# Altium schematic sheet Brain-PCB_MASTER.SchDoc
size B; SheetNumber: 1; SheetTotal: 12
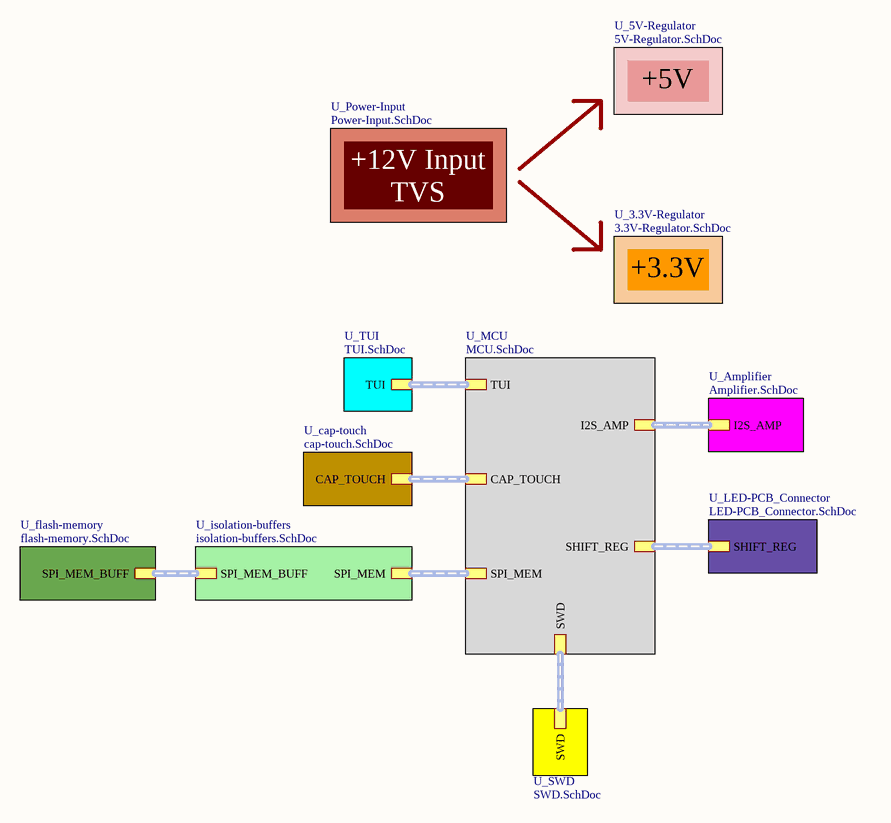
[diagram p0: Brain-PCB_MASTER.SchDoc]

## Sub-sheets
U_3.3V-Regulator = 3.3V-Regulator.SchDoc: no entries
U_5V-Regulator = 5V-Regulator.SchDoc: no entries
U_Amplifier = Amplifier.SchDoc: I2S_AMP (harness I2S_AMP)
U_cap-touch = cap-touch.SchDoc: CAP_TOUCH (harness CAP_TOUCH)
U_flash-memory = flash-memory.SchDoc: SPI_MEM_BUFF (harness SPI_MEM_BUFF)
U_isolation-buffers = isolation-buffers.SchDoc: SPI_MEM (harness SPI_MEM), SPI_MEM_BUFF (harness SPI_MEM_BUFF)
U_LED-PCB_Connector = LED-PCB_Connector.SchDoc: SHIFT_REG (harness SHIFT_REG)
U_MCU = MCU.SchDoc: SPI_MEM (harness SPI_MEM), I2S_AMP (harness I2S_AMP), SHIFT_REG (harness SHIFT_REG), TUI (harness TUI), SWD (harness SWD), CAP_TOUCH (harness CAP_TOUCH)
U_Power-Input = Power-Input.SchDoc: no entries
U_SWD = SWD.SchDoc: SWD (harness SWD)
U_TUI = TUI.SchDoc: TUI (harness TUI)

## Buses and harness runs
harness sheet U_Amplifier/I2S_AMP = sheet U_MCU/I2S_AMP
harness sheet U_cap-touch/CAP_TOUCH = sheet U_MCU/CAP_TOUCH
harness sheet U_flash-memory/SPI_MEM_BUFF = sheet U_isolation-buffers/SPI_MEM_BUFF
harness sheet U_isolation-buffers/SPI_MEM = sheet U_MCU/SPI_MEM
harness sheet U_LED-PCB_Connector/SHIFT_REG = sheet U_MCU/SHIFT_REG
harness sheet U_MCU/SWD = sheet U_SWD/SWD
harness sheet U_MCU/TUI = sheet U_TUI/TUI

## Notes on the sheet
- +5V
- +12V Input
  TVS
- +3.3V